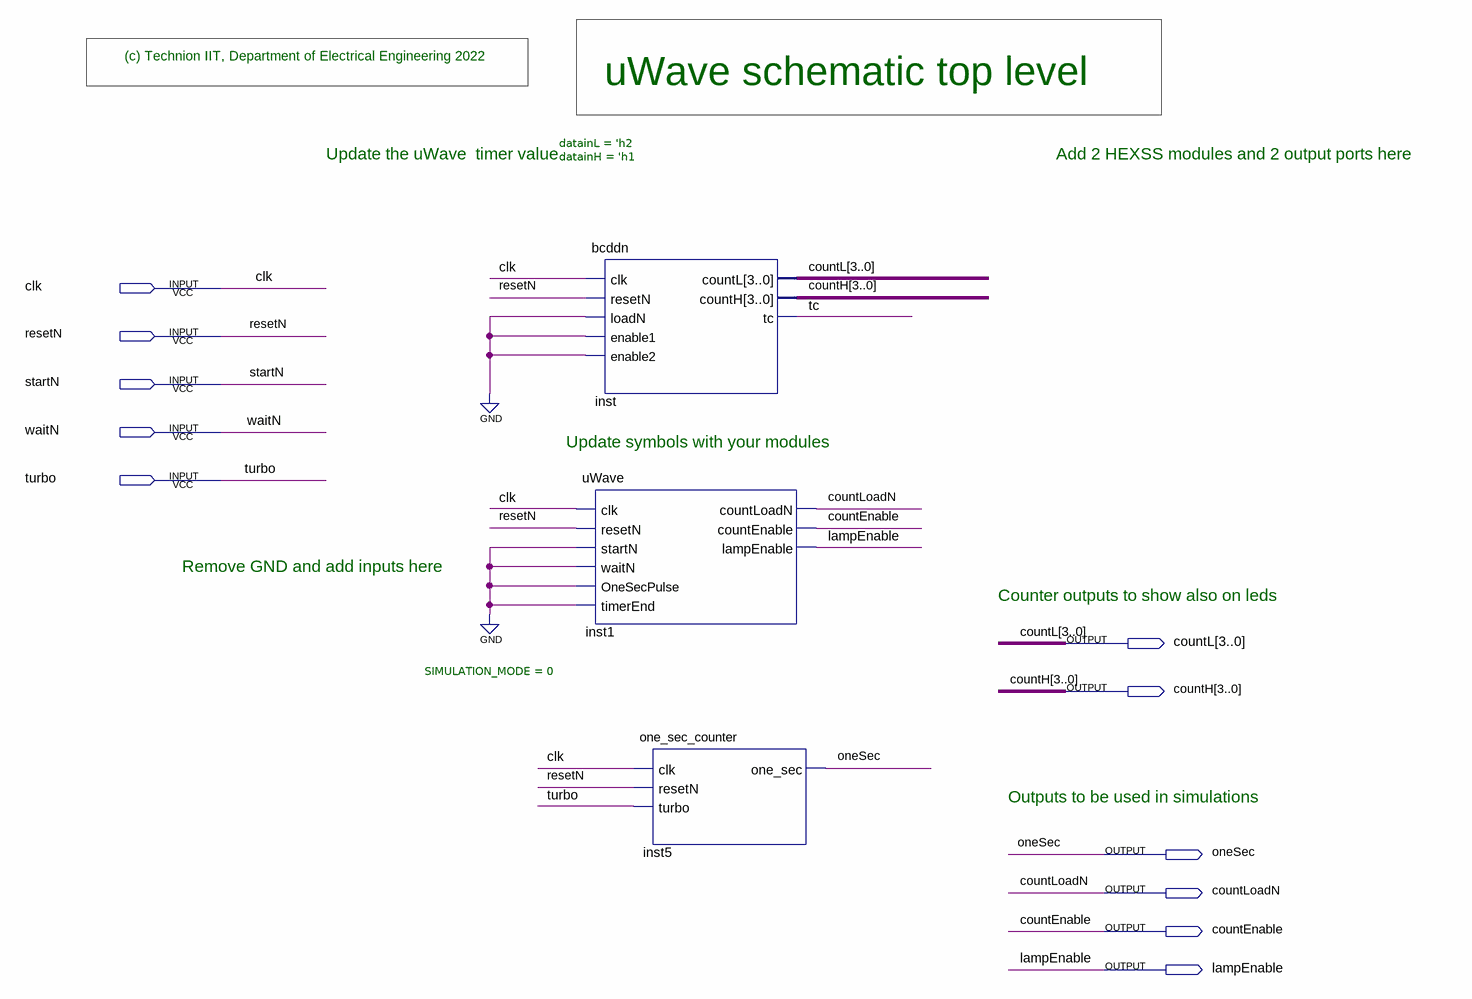
[diagram p0: schematic sheet]
// Quartus schematic uWaveTop.bdf as structural Verilog: 3 symbols, 11 pins
module uWaveTop (
  input  clk,
  input  resetN,
  input  startN,
  input  waitN,
  input  turbo,
  output [3:0] countL,
  output [3:0] countH,
  output oneSec,
  output countLoadN,
  output countEnable,
  output lampEnable
);

  wire tc;

  uWave inst1 (
    .clk(clk), .resetN(resetN), .startN(1'b0), .waitN(1'b0), .OneSecPulse(1'b0), .timerEnd(1'b0),
    .countLoadN(countLoadN), .countEnable(countEnable), .lampEnable(lampEnable));
  bcddn #(.datainL('h2), .datainH('h1)) inst (
    .clk(clk), .resetN(resetN), .loadN(1'b0), .enable1(1'b0), .enable2(1'b0), .countL(countL),
    .countH(countH), .tc(tc));
  one_sec_counter #(.SIMULATION_MODE(0)) inst5 (.clk(clk), .resetN(resetN), .turbo(turbo), .one_sec(oneSec));

  // Notes on the sheet:
  //   (c) Technion IIT, Department of Electrical Engineering 2022 
  //   uWave schematic top level  
  //   Update the uWave  timer value
  //   Add 2 HEXSS modules and 2 output ports here
  //   Update symbols with your modules
  //   Remove GND and add inputs here
  //   Counter outputs to show also on leds
  //   Outputs to be used in simulations
endmodule
